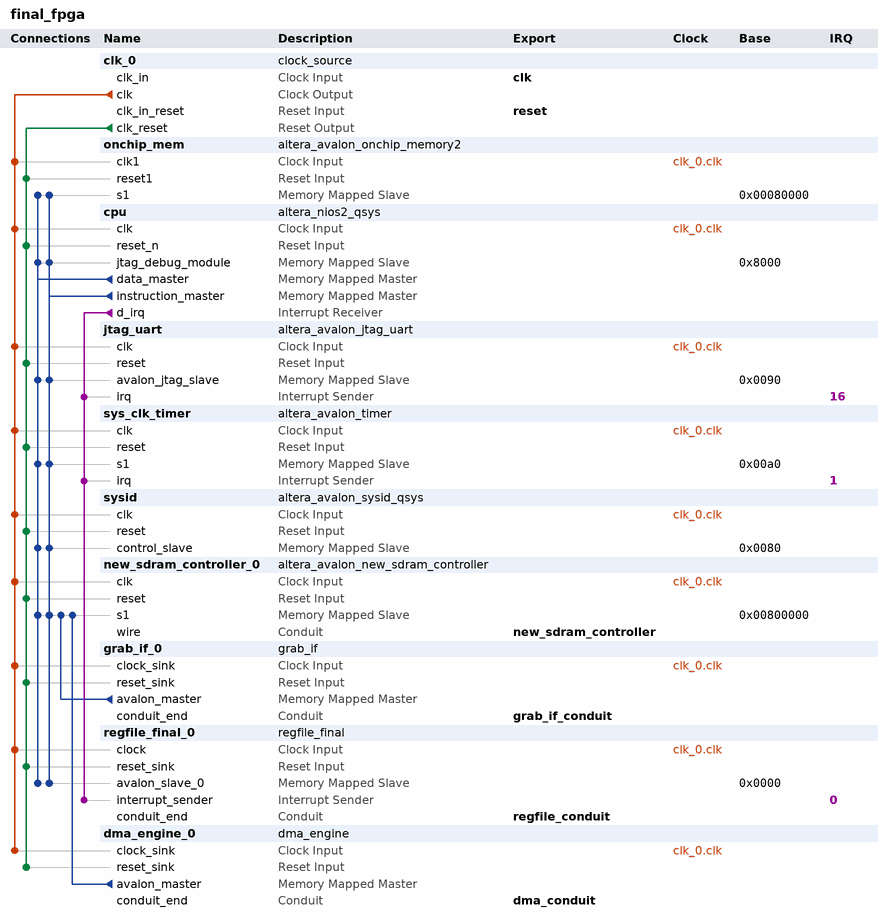
[diagram p0: system contents]
# Platform Designer (Qsys) system final_fpga, Cyclone II EP2C35F672C6
# Parameters at their usual value, and those the tool derives, are not listed.
package require -exact qsys 13.0.1
create_system final_fpga
set_project_property DEVICE_FAMILY {Cyclone II}
set_project_property DEVICE EP2C35F672C6

add_instance clk_0 clock_source 13.0
set_instance_parameter_value clk_0 clockFrequency 100000000

add_instance onchip_mem altera_avalon_onchip_memory2 13.0.1
set_instance_parameter_value onchip_mem dataWidth 32
set_instance_parameter_value onchip_mem dualPort false
set_instance_parameter_value onchip_mem initMemContent true
set_instance_parameter_value onchip_mem initializationFileName onchip_mem.hex
set_instance_parameter_value onchip_mem memorySize 20480

add_instance cpu altera_nios2_qsys 13.0
set_instance_parameter_value cpu resetSlave onchip_mem.s1
set_instance_parameter_value cpu mmu_TLBMissExcSlave None
set_instance_parameter_value cpu exceptionSlave onchip_mem.s1
set_instance_parameter_value cpu breakSlave cpu.jtag_debug_module
set_instance_parameter_value cpu impl Small
set_instance_parameter_value cpu icache_size 2048

add_instance jtag_uart altera_avalon_jtag_uart 13.0.1
set_instance_parameter_value jtag_uart simInteractiveOptions NO_INTERACTIVE_WINDOWS

add_instance sys_clk_timer altera_avalon_timer 13.0.1
set_instance_parameter_value sys_clk_timer period 1
set_instance_parameter_value sys_clk_timer periodUnits MSEC

add_instance sysid altera_avalon_sysid_qsys 13.0
set_instance_parameter_value sysid id 7

add_instance new_sdram_controller_0 altera_avalon_new_sdram_controller 13.0.1
set_instance_parameter_value new_sdram_controller_0 TAC 5.5
set_instance_parameter_value new_sdram_controller_0 TRCD 20.0
set_instance_parameter_value new_sdram_controller_0 TRP 20.0
set_instance_parameter_value new_sdram_controller_0 casLatency 3
set_instance_parameter_value new_sdram_controller_0 columnWidth 8
set_instance_parameter_value new_sdram_controller_0 dataWidth 16
set_instance_parameter_value new_sdram_controller_0 generateSimulationModel false
set_instance_parameter_value new_sdram_controller_0 model single_Micron_MT48LC4M32B2_7_chip
set_instance_parameter_value new_sdram_controller_0 numberOfBanks 4
set_instance_parameter_value new_sdram_controller_0 numberOfChipSelects 1
set_instance_parameter_value new_sdram_controller_0 powerUpDelay 100.0
set_instance_parameter_value new_sdram_controller_0 refreshPeriod 15.625
set_instance_parameter_value new_sdram_controller_0 rowWidth 12

add_instance grab_if_0 grab_if 1.1
set_instance_parameter_value grab_if_0 size_in 8
set_instance_parameter_value grab_if_0 size_out 16
set_instance_parameter_value grab_if_0 addrsize 23

add_instance regfile_final_0 regfile_final 1.0

add_instance dma_engine_0 dma_engine 1.0
set_instance_parameter_value dma_engine_0 size_in 8
set_instance_parameter_value dma_engine_0 size_out 16
set_instance_parameter_value dma_engine_0 addrsize 23

# connections
add_connection clk_0.clk cpu.clk clock
add_connection clk_0.clk dma_engine_0.clock_sink clock
add_connection clk_0.clk grab_if_0.clock_sink clock
add_connection clk_0.clk jtag_uart.clk clock
add_connection clk_0.clk new_sdram_controller_0.clk clock
add_connection clk_0.clk onchip_mem.clk1 clock
add_connection clk_0.clk regfile_final_0.clock clock
add_connection clk_0.clk sys_clk_timer.clk clock
add_connection clk_0.clk sysid.clk clock
add_connection clk_0.clk_reset cpu.reset_n reset
add_connection clk_0.clk_reset dma_engine_0.reset_sink reset
add_connection clk_0.clk_reset grab_if_0.reset_sink reset
add_connection clk_0.clk_reset jtag_uart.reset reset
add_connection clk_0.clk_reset new_sdram_controller_0.reset reset
add_connection clk_0.clk_reset onchip_mem.reset1 reset
add_connection clk_0.clk_reset regfile_final_0.reset_sink reset
add_connection clk_0.clk_reset sys_clk_timer.reset reset
add_connection clk_0.clk_reset sysid.reset reset
add_connection cpu.data_master cpu.jtag_debug_module avalon
set_connection_parameter_value cpu.data_master/cpu.jtag_debug_module baseAddress 0x8000
add_connection cpu.data_master jtag_uart.avalon_jtag_slave avalon
set_connection_parameter_value cpu.data_master/jtag_uart.avalon_jtag_slave baseAddress 0x0090
add_connection cpu.data_master new_sdram_controller_0.s1 avalon
set_connection_parameter_value cpu.data_master/new_sdram_controller_0.s1 baseAddress 0x00800000
add_connection cpu.data_master onchip_mem.s1 avalon
set_connection_parameter_value cpu.data_master/onchip_mem.s1 baseAddress 0x00080000
add_connection cpu.data_master regfile_final_0.avalon_slave_0 avalon
set_connection_parameter_value cpu.data_master/regfile_final_0.avalon_slave_0 baseAddress 0x0000
add_connection cpu.data_master sys_clk_timer.s1 avalon
set_connection_parameter_value cpu.data_master/sys_clk_timer.s1 baseAddress 0x00a0
add_connection cpu.data_master sysid.control_slave avalon
set_connection_parameter_value cpu.data_master/sysid.control_slave baseAddress 0x0080
add_connection cpu.instruction_master cpu.jtag_debug_module avalon
set_connection_parameter_value cpu.instruction_master/cpu.jtag_debug_module baseAddress 0x8000
add_connection cpu.instruction_master jtag_uart.avalon_jtag_slave avalon
set_connection_parameter_value cpu.instruction_master/jtag_uart.avalon_jtag_slave baseAddress 0x0090
add_connection cpu.instruction_master new_sdram_controller_0.s1 avalon
set_connection_parameter_value cpu.instruction_master/new_sdram_controller_0.s1 baseAddress 0x00800000
add_connection cpu.instruction_master onchip_mem.s1 avalon
set_connection_parameter_value cpu.instruction_master/onchip_mem.s1 baseAddress 0x00080000
add_connection cpu.instruction_master regfile_final_0.avalon_slave_0 avalon
set_connection_parameter_value cpu.instruction_master/regfile_final_0.avalon_slave_0 baseAddress 0x0000
add_connection cpu.instruction_master sys_clk_timer.s1 avalon
set_connection_parameter_value cpu.instruction_master/sys_clk_timer.s1 baseAddress 0x00a0
add_connection cpu.instruction_master sysid.control_slave avalon
set_connection_parameter_value cpu.instruction_master/sysid.control_slave baseAddress 0x0080
add_connection dma_engine_0.avalon_master new_sdram_controller_0.s1 avalon
set_connection_parameter_value dma_engine_0.avalon_master/new_sdram_controller_0.s1 baseAddress 0x00800000
add_connection grab_if_0.avalon_master new_sdram_controller_0.s1 avalon
set_connection_parameter_value grab_if_0.avalon_master/new_sdram_controller_0.s1 arbitrationPriority 64
set_connection_parameter_value grab_if_0.avalon_master/new_sdram_controller_0.s1 baseAddress 0x00800000
add_connection cpu.d_irq jtag_uart.irq interrupt
set_connection_parameter_value cpu.d_irq/jtag_uart.irq irqNumber 16
add_connection cpu.d_irq regfile_final_0.interrupt_sender interrupt
set_connection_parameter_value cpu.d_irq/regfile_final_0.interrupt_sender irqNumber 0
add_connection cpu.d_irq sys_clk_timer.irq interrupt
set_connection_parameter_value cpu.d_irq/sys_clk_timer.irq irqNumber 1

# exported interfaces
add_interface clk clock sink
set_interface_property clk EXPORT_OF clk_0.clk_in
add_interface reset reset sink
set_interface_property reset EXPORT_OF clk_0.clk_in_reset
add_interface new_sdram_controller conduit end
set_interface_property new_sdram_controller EXPORT_OF new_sdram_controller_0.wire
add_interface grab_if_conduit conduit end
set_interface_property grab_if_conduit EXPORT_OF grab_if_0.conduit_end
add_interface regfile_conduit conduit end
set_interface_property regfile_conduit EXPORT_OF regfile_final_0.conduit_end
add_interface dma_conduit conduit end
set_interface_property dma_conduit EXPORT_OF dma_engine_0.conduit_end

set_interconnect_requirement {$system} qsys_mm.clockCrossingAdapter HANDSHAKE
set_interconnect_requirement {$system} qsys_mm.maxAdditionalLatency 1

save_system final_fpga.qsys
